# EAGLE design TPDH-Walrus (EAGLE 9.2.2)
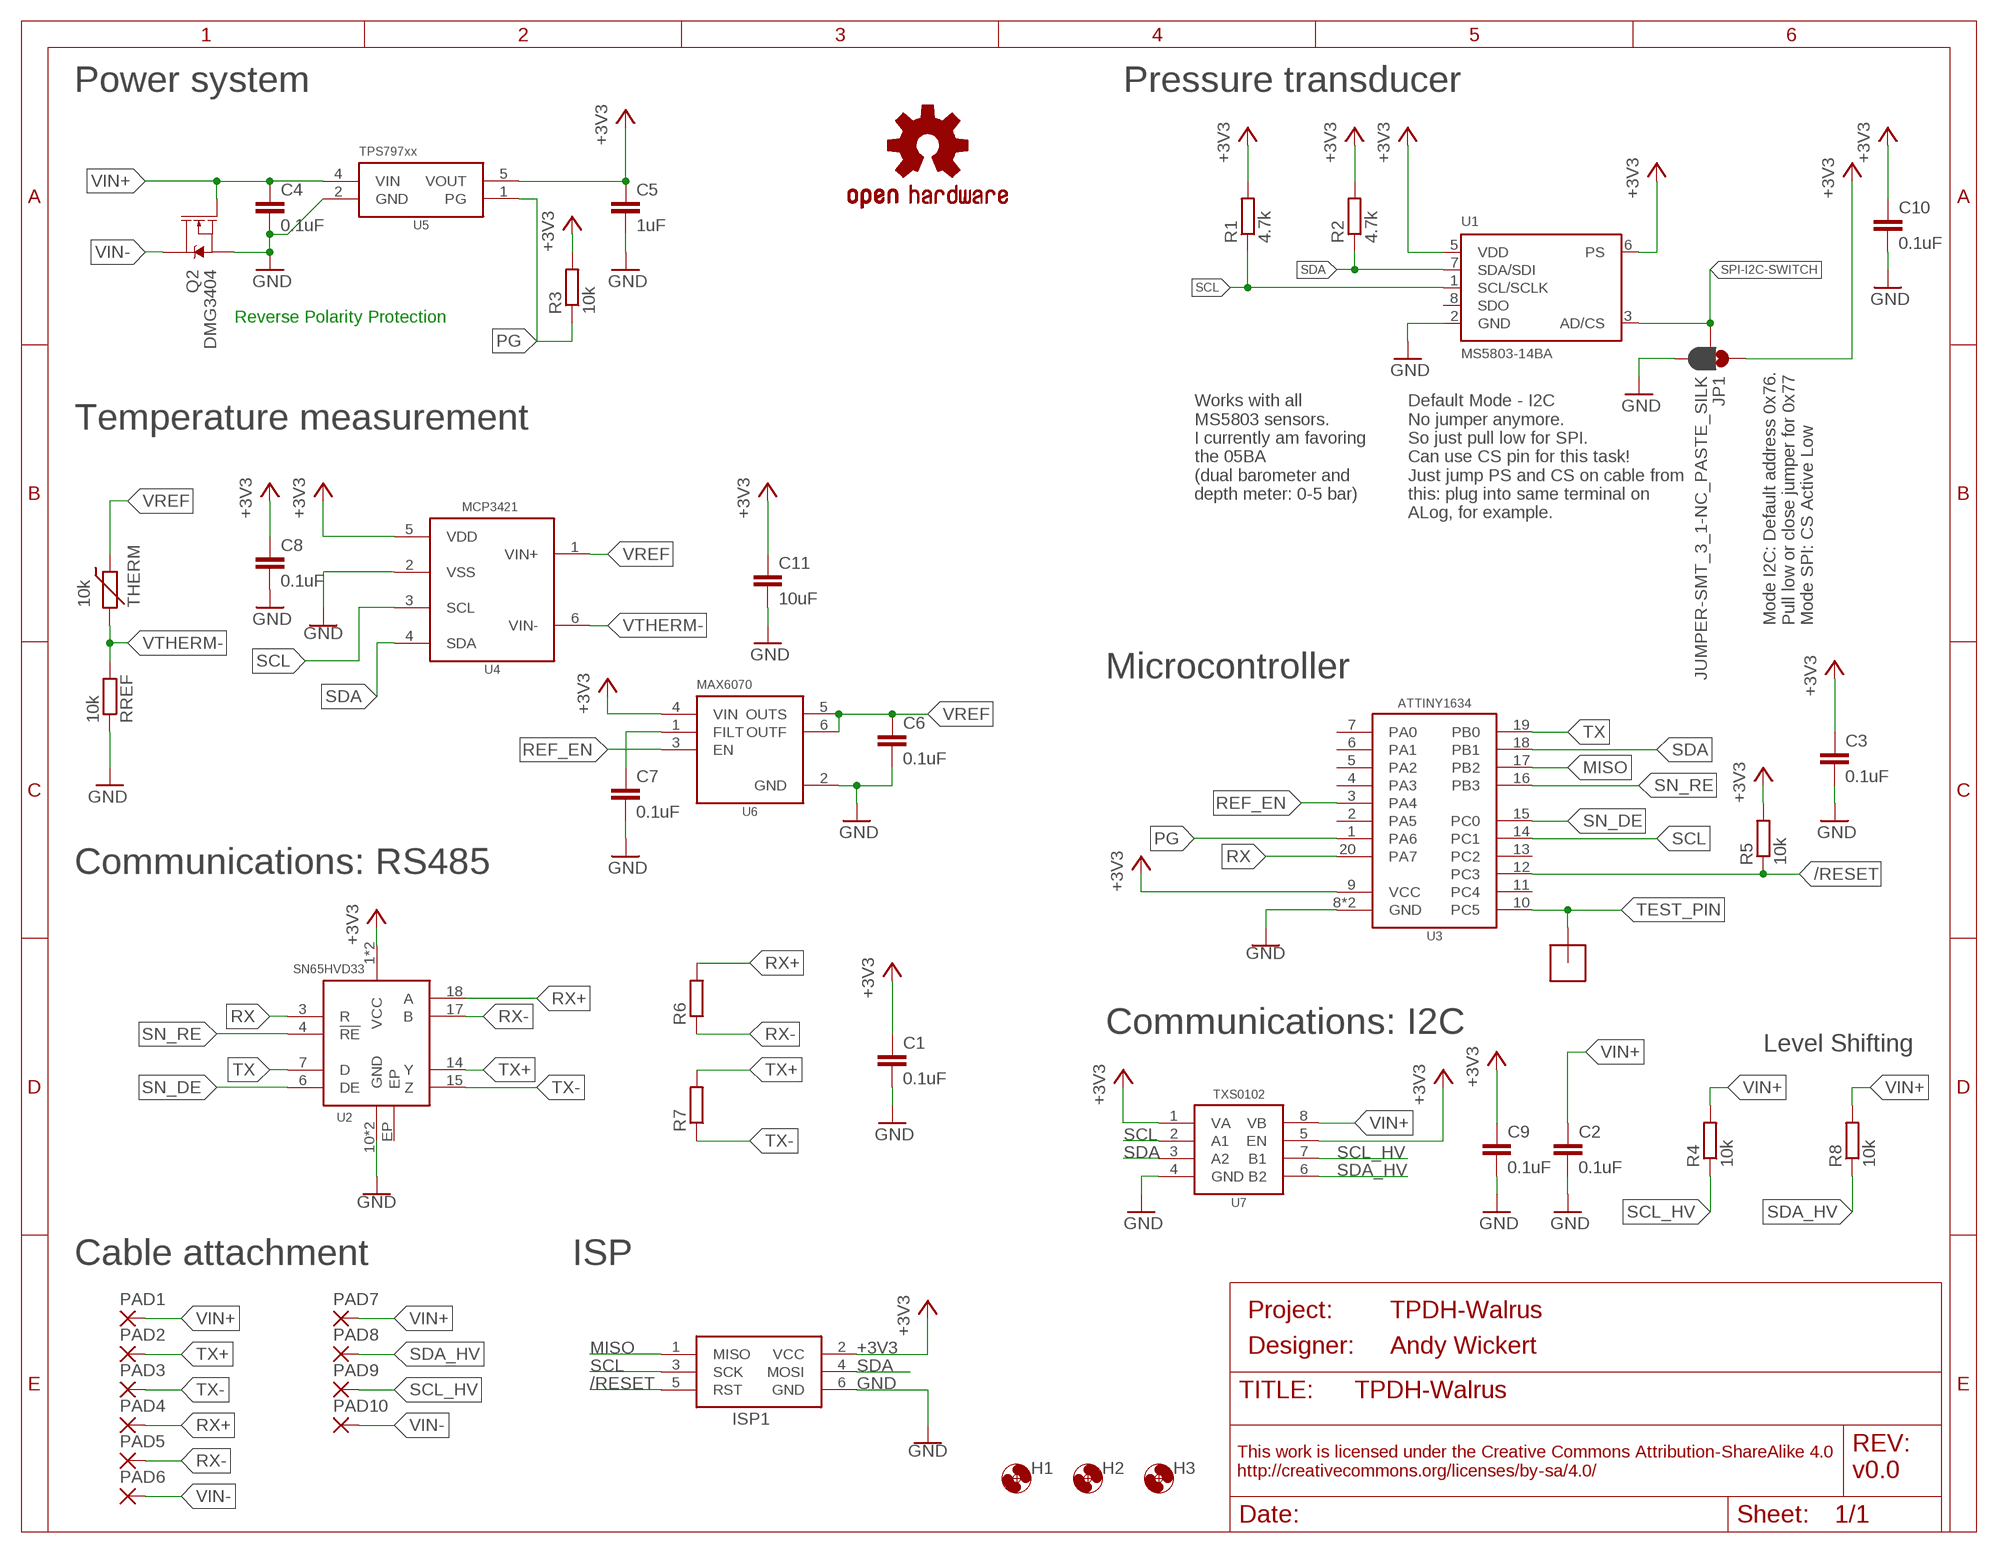
[diagram p0: schematic, sheet 1]
FRAME1 (FRAME_A_L): DESIGNER: Andy Wickert; PROJECT: TPDH-Walrus; REV: v0.0

## Parts
C1  0.1uF  C-EU0.1UFC0402  [C0402]
C2  0.1uF  C-EU0.1UFC0402  [C0402]
C3  0.1uF  C-EU0.1UFC0402  [C0402]
C4  0.1uF  C-EU0.1UFC0402  [C0402]
C5  1uF  C-EU1UFC0603  [C0603]
C6  0.1uF  C-EU0.1UFC0402  [C0402]
C7  0.1uF  C-EU0.1UFC0402  [C0402]
C8  0.1uF  C-EU0.1UFC0402  [C0402]
C9  0.1uF  C-EU0.1UFC0402  [C0402]
C10  0.1uF  C-EU0.1UFC0402  [C0402]
C11  10uF  C-EU10UFC0805  [C0805]
H1  MOUNTING_HOLE2_NP  [2_56]
H2  MOUNTING_HOLE2_NP  [2_56]
H3  MOUNTING_HOLE2_NP  [2_56]
ISP1  AVRISP-6  [AVRISP]
JP1  JUMPER-SMT_3_1-NC_PASTE_SILK  [SMT-JUMPER_3_1-NC_PASTE_SILK]
LOGO1  OSHW-LOGOM  [OSHW-LOGO-M]
PAD1  2,15/1,0  [2,15/1,0]
PAD2  2,15/1,0  [2,15/1,0]
PAD3  2,15/1,0  [2,15/1,0]
PAD4  2,15/1,0  [2,15/1,0]
PAD5  2,15/1,0  [2,15/1,0]
PAD6  2,15/1,0  [2,15/1,0]
PAD7  2,15/1,0  [2,15/1,0]
PAD8  2,15/1,0  [2,15/1,0]
PAD9  2,15/1,0  [2,15/1,0]
PAD10  2,15/1,0  [2,15/1,0]
Q2  DMG3404  MOSFET-NCH-DMG3404L  [SOT23-3]
R1  4.7k  R-EU_4.7KR0402  [R0402]
R2  4.7k  R-EU_4.7KR0402  [R0402]
R3  10k  R-EU_10KR0402  [R0402]
R4  10k  R-EU_10KR0402  [R0402]
R5  10k  R-EU_10KR0402  [R0402]
R6  R-EU_100R0402  [R0402]
R7  R-EU_100R0402  [R0402]
R8  10k  R-EU_10KR0402  [R0402]
RREF  10k  R-EU_P10KR0603  [R0603]
THERM  10k  THERMISTOR10K  [R0603]
U1  MS5803-14BA  [MS5803]
U2  SN65HVD33RHL  [VQFN-20_POWER]
U3  ATTINY1634QFN  [QFN20]
U4  MCP3421A3  [SOT23-6L]
U5  TPS79733  [DCK_R-PDSO-G5]
U6  MAX6070AAUT18  [SOT23-6L]
U7  TXS0102DQM  [DQM_R-PX2SON-N8]
U$12  POGO_PAD  [POGO_PAD]

## Nets
+3V3: C1.1 C3.1 C5.1 C8.1 C9.1 C10.1 C11.1 ISP1.2(VCC) JP1.1 R1.2 R2.2 R3.2 R5.2 U1.5(VDD) U1.6(PS) U2.1(VCC) U2.20(VCC) U3.9(VCC) U4.5(VDD) U5.5(VOUT) U6.4(VIN) U7.1(VA) U7.5(EN)
/RESET: ISP1.5(RST) R5.1 U3.12(PC3)
GND: C1.2 C2.2 C3.2 C4.2 C5.2 C6.2 C7.2 C8.2 C9.2 C10.2 C11.2 ISP1.6(GND) JP1.3 Q2.2(S) RREF.1 U1.2(GND) U2.10(GND) U2.11(GND) U3.8(GND) U3.EP(GND) U4.2(VSS) U5.2(GND) U6.2(GND) U7.4(GND)
MISO: ISP1.1(MISO) U3.17(PB2)
N$11: C7.1 U6.1(FILT)
PG: R3.1 U3.1(PA6) U5.1(PG)
REF_EN: U3.3(PA4) U6.3(EN)
RX: U2.3(R) U3.20(PA7)
RX+: PAD4.1(P) R6.2 U2.18(A)
RX-: PAD5.1(P) R6.1 U2.17(B)
SCL: ISP1.3(SCK) R1.1 U1.1(SCL/SCLK) U3.14(PC1) U4.3(SCL) U7.2(A1)
SCL_HV: PAD9.1(P) R4.1 U7.7(B1)
SDA: ISP1.4(MOSI) R2.1 U1.7(SDA/SDI) U3.18(PB1) U4.4(SDA) U7.3(A2)
SDA_HV: PAD8.1(P) R8.1 U7.6(B2)
SN_DE: U2.6(DE) U3.15(PC0)
SN_RE: U2.4(!RE) U3.16(PB3)
SPI-I2C-SWITCH: JP1.2 U1.3(AD/CS)
TEST_PIN: U3.10(PC5) U$12.P$1
TX: U2.7(D) U3.19(PB0)
TX+: PAD2.1(P) R7.2 U2.14(Y)
TX-: PAD3.1(P) R7.1 U2.15(Z)
VIN+: C2.1 C4.1 PAD1.1(P) PAD7.1(P) Q2.1(G) R4.2 R8.2 U5.4(VIN) U7.8(VB)
VIN-: PAD6.1(P) PAD10.1(P) Q2.3(D)
VREF: C6.1 THERM.1 U4.1(VIN+) U6.5(OUTS) U6.6(OUTF)
VTHERM-: RREF.2 THERM.2 U4.6(VIN-)
Unconnected: U1.8(SDO) U2.EP U3.2(PA5) U3.4(PA3) U3.5(PA2) U3.6(PA1) U3.7(PA0) U3.11(PC4) U3.13(PC2)

## Notes on the sheet
- Power system | Pressure transducer
- Reverse Polarity Protection
- Works with all
  MS5803 sensors.
  I currently am favoring
  the 05BA
  (dual barometer and
  depth meter: 0-5 bar)
- Default Mode - I2C
  No jumper anymore.
  So just pull low for SPI.
  Can use CS pin for this task!
  Just jump PS and CS on cable from
  this: plug into same terminal on
  ALog, for example.
- Temperature measurement
- Mode I2C: Default address 0x76.
  Pull low or close jumper for 0x77
  Mode SPI: CS Active Low
- Microcontroller
- Communications: RS485
- Communications: I2C
- Level Shifting
- Cable attachment | ISP

## Library data of the parts
C1-C4 C6-C10 = bschulz_passives:C-EU: CAPACITOR, European symbol; DIGIKEY: 490-4759-1-ND; MF: Murata; MPN: GCM155R71C104KA55D
C5 = bschulz_passives:C-EU: CAPACITOR, European symbol; DIGIKEY: 490-10479-1-ND; MF: Murata; MPN: GRM188R61C105KA12D
C11 = bschulz:C-EU: CAPACITOR, European symbol; DIGIKEY: 1276-2405-1-ND; MF: Samsung; MPN: CL21A106KQCLRNC
H1-H3 = bschulz:MOUNTING_HOLE: Genaric Mechanical Mounting Hole Hole diameter based on max body diameter + 15% Keepout ring is for diameter of socket cap screw (minimum required clearance) TPlace ring is for diameter of pan head screw (recomended clearance) Specifications: Socket Cap <http://fastener-express.com/fastener-technical/SocketscapSS-Alloy.pdf> Button Head Socket Cap <http://fastener-express.com/fastener-technical/Button-Socket-alloy.pdf> Pan Head <http://fastener-express.com/fastener-technical/pan-machine-Screws.pdf>
ISP1 = bschulz:AVRISP: AVR ISP HEADER Standard 6 pin header for AVR programming
JP1 = SparkFun-Jumpers:JUMPER-SMT_3_1-NC_PASTE: Normally closed solder jumper (1 of 2 connections) This jumper has an aperture in the stencil to allow solder paste to bridge one of the two connections. One connection is normally closed (NC), while the other is normally open (NO). Wick off the solder to open the connection. Reapply solder to reclose the connection. Apply solder to the other side instead to change the current path.
LOGO1 = SparkFun-Aesthetics:OSHW-LOGO: Open-Source Hardware (OSHW) Logo This logo indicates the piece of hardware it is found on incorporates a OSHW license and/or adheres to the definition of open source hardware found here: http://freedomdefined.org/OSHW
PAD1-PAD10 = wirepad:2,15/1,0: THROUGH-HOLE PAD
Q2 = bschulz:MOSFET-NCH: N-channel MOSFETs Voltage controlled devices that allow control of high current outputs. SparkFun Products: SparkFun OpenScale <https://www.sparkfun.com/products/13261> SparkFun Digital Sandbox <https://www.sparkfun.com/products/12651> SparkFun Monster Moto Shield <https://www.sparkfun.com/products/10182> SparkFun MOSFET Power Controller <https://www.sparkfun.com/products/11214>; DIGIKEY: DMG3404L-7DICT-ND; MF: Diodes Incorporated; MPN: DMG3404L-7
R1 R2 = bschulz_passives:R-EU_: RESISTOR, European symbol Digikey Parts: Yageo, 0402 <https://www.digikey.com/products/en/resistors/chip-resistor-surface-mount/52?k=&pkeyword=&sf=0&FV=ffec1104%2Cfffc000d%2C1c0002%2C440067%2C1f140000%2Cffe00034%2C400004&quantity=&ColumnSort=0&page=1&stock=1&pageSize=25> Yageo, 0603 <https://www.digikey.com/products/en/resistors/chip-resistor-surface-mount/52?k=&pkeyword=&s=4356&s=47360&sf=0&FV=fffc000d%2C1c0002%2C142c040c%2C1f140000%2Cffe00034&quantity=10&ColumnSort=1000011&page=1&stock=1&pageSize=25> Panasonic, 0603 <https://www.digikey.com/products/en/resistors/chip-resistor-surface-mount/52?k=&pkeyword=&pv252=68&sf=0&FV=ffec373d%2C1c0002%2C142c040c%2C1f140000%2Cffe00034%2C80002%2Cc0001&quantity=&ColumnSort=0&page=1&stock=1&pageSize=25> Panasonic, precision, 0603 <https://www.digikey.com/products/en/resistors/chip-resistor-surface-mount/52?FV=ffec4907%2Cfffc000a%2Cc0172%2C142c040c%2C1f140000%2Cffe00034%2C1c0002&quantity=100&ColumnSort=2085&page=1&stock=1&pageSize=25> Panasonic, 0805 <https://www.digikey.com/products/en/resistors/chip-resistor-surface-mount/52?k=&pkeyword=&pv3=1&sf=0&FV=ffec373d%2C1c0002%2C1f140000%2Cffe00034%2C142c040d&quantity=&ColumnSort=0&page=1&stock=1&pageSize=25> Rohm, current sense <https://www.digikey.com/products/en/resistors/chip-resistor-surface-mount/52?k=&pkeyword=&pv3=1&sf=0&FV=ffecb688%2C1f140000%2Cffe00034%2C1c0002&quantity=&ColumnSort=0&page=1&stock=1&pageSize=25> Vishay, pulse proof automotive <https://www.digikey.com/products/en/resistors/chip-resistor-surface-mount/52?k=&pkeyword=&pv7=2&sf=0&FV=ffec5d6b%2Cffe00034%2C1f140000&quantity=&ColumnSort=0&page=1&stock=1&pageSize=25>; DIGIKEY: 311-4.7KJRCT-ND; MF: Yageo; MPN: RC0402JR-074K7L; VALUE_PART: 4.7k
R3-R5 R8 = bschulz_passives:R-EU_: RESISTOR, European symbol Digikey Parts: Yageo, 0402 <https://www.digikey.com/products/en/resistors/chip-resistor-surface-mount/52?k=&pkeyword=&sf=0&FV=ffec1104%2Cfffc000d%2C1c0002%2C440067%2C1f140000%2Cffe00034%2C400004&quantity=&ColumnSort=0&page=1&stock=1&pageSize=25> Yageo, 0603 <https://www.digikey.com/products/en/resistors/chip-resistor-surface-mount/52?k=&pkeyword=&s=4356&s=47360&sf=0&FV=fffc000d%2C1c0002%2C142c040c%2C1f140000%2Cffe00034&quantity=10&ColumnSort=1000011&page=1&stock=1&pageSize=25> Panasonic, 0603 <https://www.digikey.com/products/en/resistors/chip-resistor-surface-mount/52?k=&pkeyword=&pv252=68&sf=0&FV=ffec373d%2C1c0002%2C142c040c%2C1f140000%2Cffe00034%2C80002%2Cc0001&quantity=&ColumnSort=0&page=1&stock=1&pageSize=25> Panasonic, precision, 0603 <https://www.digikey.com/products/en/resistors/chip-resistor-surface-mount/52?FV=ffec4907%2Cfffc000a%2Cc0172%2C142c040c%2C1f140000%2Cffe00034%2C1c0002&quantity=100&ColumnSort=2085&page=1&stock=1&pageSize=25> Panasonic, 0805 <https://www.digikey.com/products/en/resistors/chip-resistor-surface-mount/52?k=&pkeyword=&pv3=1&sf=0&FV=ffec373d%2C1c0002%2C1f140000%2Cffe00034%2C142c040d&quantity=&ColumnSort=0&page=1&stock=1&pageSize=25> Rohm, current sense <https://www.digikey.com/products/en/resistors/chip-resistor-surface-mount/52?k=&pkeyword=&pv3=1&sf=0&FV=ffecb688%2C1f140000%2Cffe00034%2C1c0002&quantity=&ColumnSort=0&page=1&stock=1&pageSize=25> Vishay, pulse proof automotive <https://www.digikey.com/products/en/resistors/chip-resistor-surface-mount/52?k=&pkeyword=&pv7=2&sf=0&FV=ffec5d6b%2Cffe00034%2C1f140000&quantity=&ColumnSort=0&page=1&stock=1&pageSize=25>; DIGIKEY: 311-10KJRCT-ND; MF: Yageo; MPN: RC0402JR-0710KL; VALUE_PART: 10k
R6 R7 = bschulz_passives:R-EU_: RESISTOR, European symbol Digikey Parts: Yageo, 0402 <https://www.digikey.com/products/en/resistors/chip-resistor-surface-mount/52?k=&pkeyword=&sf=0&FV=ffec1104%2Cfffc000d%2C1c0002%2C440067%2C1f140000%2Cffe00034%2C400004&quantity=&ColumnSort=0&page=1&stock=1&pageSize=25> Yageo, 0603 <https://www.digikey.com/products/en/resistors/chip-resistor-surface-mount/52?k=&pkeyword=&s=4356&s=47360&sf=0&FV=fffc000d%2C1c0002%2C142c040c%2C1f140000%2Cffe00034&quantity=10&ColumnSort=1000011&page=1&stock=1&pageSize=25> Panasonic, 0603 <https://www.digikey.com/products/en/resistors/chip-resistor-surface-mount/52?k=&pkeyword=&pv252=68&sf=0&FV=ffec373d%2C1c0002%2C142c040c%2C1f140000%2Cffe00034%2C80002%2Cc0001&quantity=&ColumnSort=0&page=1&stock=1&pageSize=25> Panasonic, precision, 0603 <https://www.digikey.com/products/en/resistors/chip-resistor-surface-mount/52?FV=ffec4907%2Cfffc000a%2Cc0172%2C142c040c%2C1f140000%2Cffe00034%2C1c0002&quantity=100&ColumnSort=2085&page=1&stock=1&pageSize=25> Panasonic, 0805 <https://www.digikey.com/products/en/resistors/chip-resistor-surface-mount/52?k=&pkeyword=&pv3=1&sf=0&FV=ffec373d%2C1c0002%2C1f140000%2Cffe00034%2C142c040d&quantity=&ColumnSort=0&page=1&stock=1&pageSize=25> Rohm, current sense <https://www.digikey.com/products/en/resistors/chip-resistor-surface-mount/52?k=&pkeyword=&pv3=1&sf=0&FV=ffecb688%2C1f140000%2Cffe00034%2C1c0002&quantity=&ColumnSort=0&page=1&stock=1&pageSize=25> Vishay, pulse proof automotive <https://www.digikey.com/products/en/resistors/chip-resistor-surface-mount/52?k=&pkeyword=&pv7=2&sf=0&FV=ffec5d6b%2Cffe00034%2C1f140000&quantity=&ColumnSort=0&page=1&stock=1&pageSize=25>; DIGIKEY: 311-100LRCT-ND; MF: Yageo; MPN: RC0402FR-07100RL; VALUE_PART: 100
RREF = bschulz_passives:R-EU_: RESISTOR, European symbol Digikey Parts: Yageo, 0402 <https://www.digikey.com/products/en/resistors/chip-resistor-surface-mount/52?k=&pkeyword=&sf=0&FV=ffec1104%2Cfffc000d%2C1c0002%2C440067%2C1f140000%2Cffe00034%2C400004&quantity=&ColumnSort=0&page=1&stock=1&pageSize=25> Yageo, 0603 <https://www.digikey.com/products/en/resistors/chip-resistor-surface-mount/52?k=&pkeyword=&s=4356&s=47360&sf=0&FV=fffc000d%2C1c0002%2C142c040c%2C1f140000%2Cffe00034&quantity=10&ColumnSort=1000011&page=1&stock=1&pageSize=25> Panasonic, 0603 <https://www.digikey.com/products/en/resistors/chip-resistor-surface-mount/52?k=&pkeyword=&pv252=68&sf=0&FV=ffec373d%2C1c0002%2C142c040c%2C1f140000%2Cffe00034%2C80002%2Cc0001&quantity=&ColumnSort=0&page=1&stock=1&pageSize=25> Panasonic, precision, 0603 <https://www.digikey.com/products/en/resistors/chip-resistor-surface-mount/52?FV=ffec4907%2Cfffc000a%2Cc0172%2C142c040c%2C1f140000%2Cffe00034%2C1c0002&quantity=100&ColumnSort=2085&page=1&stock=1&pageSize=25> Panasonic, 0805 <https://www.digikey.com/products/en/resistors/chip-resistor-surface-mount/52?k=&pkeyword=&pv3=1&sf=0&FV=ffec373d%2C1c0002%2C1f140000%2Cffe00034%2C142c040d&quantity=&ColumnSort=0&page=1&stock=1&pageSize=25> Rohm, current sense <https://www.digikey.com/products/en/resistors/chip-resistor-surface-mount/52?k=&pkeyword=&pv3=1&sf=0&FV=ffecb688%2C1f140000%2Cffe00034%2C1c0002&quantity=&ColumnSort=0&page=1&stock=1&pageSize=25> Vishay, pulse proof automotive <https://www.digikey.com/products/en/resistors/chip-resistor-surface-mount/52?k=&pkeyword=&pv7=2&sf=0&FV=ffec5d6b%2Cffe00034%2C1f140000&quantity=&ColumnSort=0&page=1&stock=1&pageSize=25>; DIGIKEY: P10KDBCT-ND; MF: Panasonic; MPN: ERA-3AEB103V; VALUE_PART: 10k
THERM = bschulz:THERMISTOR: Thermistor NTC Thermistors: Digikey = 490-12101-1-ND, R25 = 47K, Package = 0603 Digikey = 490-16279-1-ND, R25 = 10K, Package = 0603; DIGIKEY: 490-16279-1-ND; MF: Murata; MPN: NCU18XH103F60RB
U1 = MS5803:MS5803-14BA; DIGIKEY: 223-1625-5-ND; MF: TE; MPN: MS580305BA01-00; PROD_ID: IC-12111
U2 = bschulz:SN65HVD33: SN65HVD33 - Full Duplex RS-485 Tranciver, with output enable Characteristics: VCC: 3~3.6V Operating Temperature: -40°C to 85°C Signaling Rate: 1, 5, 26 Mbps (depending on model) Digikey: 296-24087-1-ND (RHL) <https://www.digikey.com/product-detail/en/texas-instruments/SN65HVD33RHLR/296-24087-1-ND/1991606> 296-18704-1-ND (D) <https://www.digikey.com/product-detail/en/texas-instruments/SN65HVD33DR/296-18704-1-ND/863533>; DIGIKEY: 296-24087-1-ND; MF: TI; MPN: SN65HVD33RHLR
U3 = bschulz:ATTINY1634: ATtiny1634 8 bit AVR Microcontroller Features: Vcc: 1.8 ~ 5.5V Clock: Up to 16MHz, Internal 8MHz FRC, 32kHz RC Flash Memory: 16K SRAM: 1K EEPROM: 256B ADC: 10b, 12 port USART: Yes, x2 SPI: Yes I2C: Yes, slave only Notes: 2 analog comp. Digikey: ATTINY1634R-MURCT-ND (QFN) <https://www.digikey.com/product-detail/en/microchip-technology/ATTINY1634R-MUR/ATTINY1634R-MURCT-ND/3440781> ATTINY1634R-SU-ND (SOIC) <https://www.digikey.com/product-detail/en/ATTINY1634R-SU/ATTINY1634R-SU-ND/3128699/?itemSeq=272981030>; DIGIKEY: ATTINY1634-MURCT-ND; MF: Atmel; MPN: ATTINY1634-MUR
U4 = bschulz:MCP342*: MCP342* - Sigma Delta ADC Characteristics: VCC: 2.7~5.5V Operating Temperature: -40°C to 125°C Number of Inputs: 1 (Differenital) Sample Rate: 15 Samples Per Second Number of Bits: 16 (MCP3425), 18 (MCP3421) Digikey: MCP3421 MCP3425A0T-E/CHCT-ND <https://www.digikey.com/product-detail/en/microchip-technology/MCP3425A0T-E-CH/MCP3425A0T-E-CHCT-ND/1979810> MCP3425 MCP3421A0T-E/CHCT-ND <https://www.digikey.com/product-detail/en/microchip-technology/MCP3421A0T-E-CH/MCP3421A0T-E-CHCT-ND/2183406> MCP3421A1T-E/CHCT-ND <https://www.digikey.com/product-detail/en/microchip-technology/MCP3421A1T-E-CH/MCP3421A1T-E-CHCT-ND/2183407> MCP3421A3T-E/CHCT-ND <https://www.digikey.com/product-detail/en/microchip-technology/MCP3421A3T-E-CH/MCP3421A3T-E-CHCT-ND/2183409>; DIGIKEY: MCP3421A3T-E/CHCT-ND; DISP: MCP3421; MF: Microchip; MPN: MCP3421A3T-E/CH
U5 = bschulz:TPS797*: TPS797* - Ultra Low Power Low Dropout Linear Regulator Characteristics: Vin: 1.4V ~ 5.5V Vout: 1.8, 2.85, 3.0, 3.3V fixed IQ: 1.2μA typ, 2μA max Voltage Accuracy: 4% max Dropout Voltage: 105mV @ 10mA Output Current: 50 mA Operating Temperature: -40°C to 85°C Digikey: TPS79733 (3.3V Fixed) <https://www.digikey.com/product-detail/en/texas-instruments/TPS79733DCKR/296-11990-1-ND/390520> TPS79730 (3.0V Fixed) <https://www.digikey.com/product-detail/en/texas-instruments/TPS79730DCKR/296-11989-1-ND/390518> TPS797285 (2.85V Fixed) <https://www.digikey.com/product-detail/en/texas-instruments/TPS797285DCKR/296-25465-1-ND/2187585> TPS79718 (1.8V Fixed) <https://www.digikey.com/product-detail/en/texas-instruments/TPS79718DCKR/296-11988-1-ND/390516>; DIGIKEY: 296-11990-1-ND; MF: TI; MPN: TPS79733DCKR
U6 = bschulz:MAX6070AAUT*: MAX6070 Low Noise high precision voltage referance; DIGIKEY: MAX6070BAUT18+TCT-ND; MF: Maxim; MPN: MAX6070BAUT18+T
U7 = bschulz:TXS0102: TXS0102 - 2 Channel Bidirectional Voltage Level Translator Characteristics: Vcc: 1.65 ~ 3.6V (Port A), 2.3 ~ 5.5V (Port B) IQ: 14.4μA Output Current: 50mA Output Type: Open Drain/Push-Pull Operating Temperature: -40°C to 85°C Digikey: 296-28368-1-ND (DQE) <https://www.digikey.com/product-detail/en/texas-instruments/TXS0102DQER/296-28368-1-ND/2625893> 296-28435-1-ND (DQM) <https://www.digikey.com/product-detail/en/texas-instruments/TXS0102DQMR/296-28435-1-ND/2638910> 296-21931-1-ND (DCU) <https://www.digikey.com/product-detail/en/texas-instruments/TXS0102DCUR/296-21931-1-ND/1629284>; DIGIKEY: 296-28435-1-ND; MF: TI; MPN: TXS0102DQMR
U$12 = bschulz:POGO_PAD: POGO Pad SMD pad for interfacing with POGO Pins

## Board
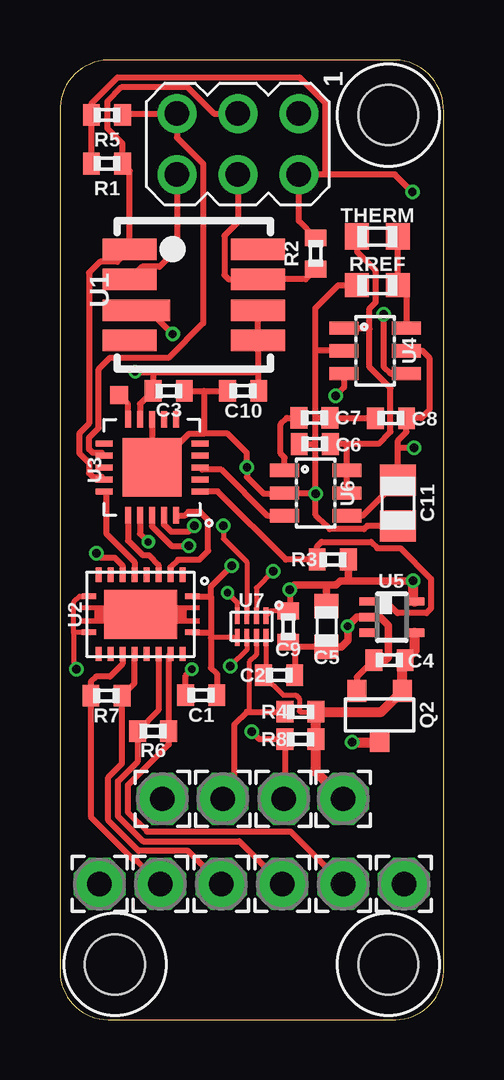
[diagram p1: board, top side]
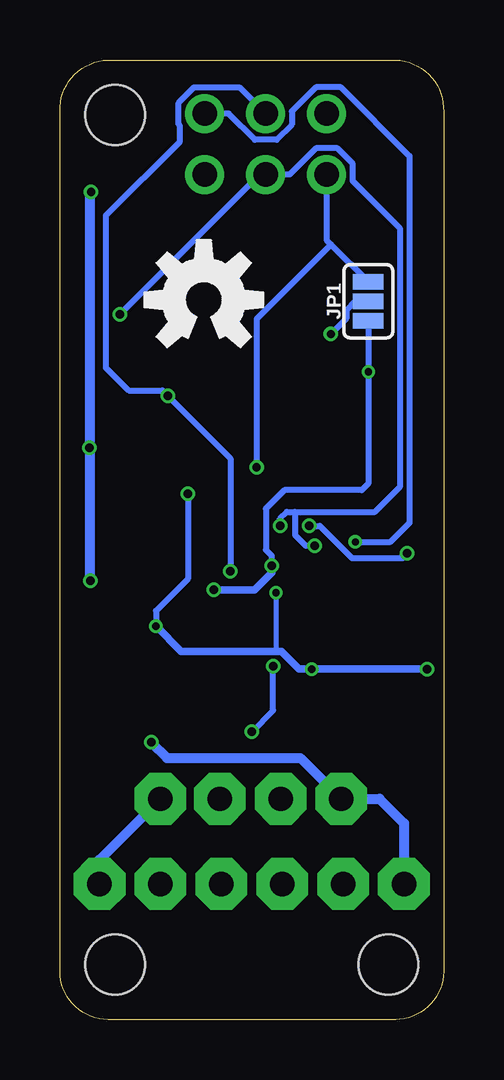
[diagram p2: board, bottom side, seen from below]

Size 16 x 40 mm. Coordinates in mm from the lower left corner, seen from the top.
Outline: 2,0 14,0 arc90 16,2 16,37.85 arc90 14,40 2,40 arc90 0,37.84 0,2 arc90 2,0
Copper layers (1*16): Top 0.035559375mm / dielectric 1.6mm / Bottom 0.035559375mm
Design rules "oshpark-2layer": minimum track width 6mil, minimum drill 10mil, track to track 6mil, track to pad 6mil, pad to pad 6mil, via to via 6mil, smd to smd 6mil, copper to edge 15mil, drill to drill 6mil, minimum pad ring 5mil, minimum via ring 5mil, stop-mask expansion 2.5mil, vias tented up to drill 0mil, thermal gap 10mil

### Footprints (pad centres in the part's own frame; a part is rotated, then mirrored left to right if it is on the bottom)
C0402 = smd 0.7 x 0.9: 1 -0.65,0; 2 0.65,0
C0603 = smd 1 x 1: 1 -0.85,0; 2 0.85,0
C0805 = smd 1.3 x 1.5: 1 -0.95,0; 2 0.95,0
2_56 = hole 2.5: 0,0
AVRISP = drill 1.02 pad 1.626: 1 -1.27,2.54; 2 1.27,2.54; 3 -1.27,0; 4 1.27,0; 5 -1.27,-2.54; 6 1.27,-2.54
SMT-JUMPER_3_1-NC_PASTE_SILK = smd 0.635 x 1.27: 1 -0.813,0; 2 0,0; 3 0.813,0
2,15/1,0 = drill 1.016 pad 2.159 octagon: 1 0,0
SOT23-3 = smd 0.8 x 0.9: 1 -0.95,-1; 2 0.95,-1; 3 0,1.1
R0402 = smd 0.7 x 0.9: 1 -0.65,0; 2 0.65,0
R0603 = smd 1 x 1: 1 -0.85,0; 2 0.85,0
R0603' = smd 1 x 1.1: 1 -0.85,0; 2 0.85,0
MS5803 = smd 2.25 x 0.9: 1 -2.675,1.9; 2 -2.675,0.65; 4 -2.675,-1.9; 5 2.675,-1.9; 6 2.675,-0.65; 7 2.675,0.65; 8 2.675,1.9 | smd 2.8 x 0.9: 3 -2.4,-0.65
VQFN-20_POWER = smd 0.24 x 0.6: 1 -0.75,2.15; 10 -0.75,-2.15; 11 0.75,-2.15; 20 0.75,2.15 | smd 0.6 x 0.24: 2 -1.65,1.75; 3 -1.65,1.25; 4 -1.65,0.75; 5 -1.65,0.25; 6 -1.65,-0.25; 7 -1.65,-0.75; 8 -1.65,-1.25; 9 -1.65,-1.75; 12 1.65,-1.75; 13 1.65,-1.25; 14 1.65,-0.75; 15 1.65,-0.25; 16 1.65,0.25; 17 1.65,0.75; 18 1.65,1.25; 19 1.65,1.75 | smd 2.05 x 3.05: EP 0,0
QFN20 = smd 0.7 x 0.25: 1 -2.032,0.968; 2 -2.032,0.468; 3 -2.032,-0.032; 4 -2.032,-0.532; 5 -2.032,-1.032; 11 1.968,-1.032; 12 1.968,-0.532; 13 1.968,-0.032; 14 1.968,0.468; 15 1.968,0.968 | smd 0.25 x 0.7: 6 -1.032,-2.032; 7 -0.532,-2.032; 8 -0.032,-2.032; 9 0.468,-2.032; 10 0.968,-2.032; 16 0.968,1.968; 17 0.468,1.968; 18 -0.032,1.968; 19 -0.532,1.968; 20 -1.032,1.968 | smd 2.45 x 2.45: EP -0.032,-0.032
SOT23-6L = smd 0.55 x 1.2: 1 -0.95,-1.3; 2 0,-1.3; 3 0.95,-1.3; 4 0.95,1.3; 5 0,1.3; 6 -0.95,1.3
DCK_R-PDSO-G5 = smd 0.35 x 0.8: 1 -0.65,-0.95; 2 0,-0.95; 3 0.65,-0.95; 4 0.65,0.95; 5 -0.65,0.95
DQM_R-PX2SON-N8 = smd 0.2 x 0.7: 1 -0.6,-0.45; 2 -0.2,-0.45; 3 0.2,-0.45; 4 0.6,-0.45; 5 0.6,0.45; 6 0.2,0.45; 7 -0.2,0.45; 8 -0.6,0.45
POGO_PAD = smd 0.75 x 0.75: P$1 0,0

### Placement (x,y rotation side)
C1  5.89,13.52 180 top
C2  9.14,14.35 0 top
C3  4.54,26.2 0 top
C4  13.75,14.98 180 top
C5  11.11,16.38 270 top
C6  10.63,23.99 180 top
C7  10.61,25.08 0 top
C8  13.81,25.07 180 top
C9  9.53,16.38 270 top
C10  7.64,26.2 180 top
C11  14.1,21.53 270 top
H1  13.7,37.7 0 top
H2  13.7,2.3 0 top
H3  2.3,2.3 0 top
ISP1  7.42,36.49 270 top
JP1  3.14,29.94 90 bottom
LOGO1  10,30 0 bottom
PAD1  14.35,5.65 0 top
PAD2  4.19,5.65 0 top
PAD3  6.73,5.65 0 top
PAD4  11.81,5.65 0 top
PAD5  9.27,5.65 0 top
PAD6  1.65,5.65 0 top
PAD7  11.81,9.2 0 top
PAD8  9.33,9.2 0 top
PAD9  6.79,9.2 0 top
PAD10  4.27,9.2 0 top
Q2  13.34,12.7 180 top
R1  1.96,35.68 180 top
R2  10.66,31.93 90 top
R3  11.38,19.18 0 top
R4  10.03,12.83 0 top
R5  1.96,37.71 180 top
R6  3.89,12.02 0 top
R7  1.94,13.5 180 top
R8  10.03,11.68 0 top
RREF  13.24,30.61 0 top
THERM  10k  [R0603']  13.24,32.64 0 top
U1  5.59,30.21 0 top
U2  3.36,16.89 270 top
U3  3.81,22.99 180 top
U4  13.15,27.88 270 top
U5  13.85,16.78 270 top
U6  10.67,21.95 270 top
U7  7.99,16.38 180 top
U$12  2.48,26.04 0 top

### Tracks (layer width: path | path; a pad name or v marks a point on that pad's centre or on a via)
+3V3  (via drill 0.3, 0.35)
  Top 0.2: C9.1 8.79,17.03 U7.1 | U7.5 6.33,15.93 6.3,15.9
  Top 0.254: U1.6 U1.5 8.26,27 | v9.59,17.92 9.59,17.1 C9.1 | U6.4 12.61,21 C11.1 14.1,23.83 | R1.2 R5.2 1.31,38.18 2.39,39.26 10.01,39.26 11.05,38.21 11.05,35.27 11,35.22 | v3.14,27 3.9,27 | 3.9,27 3.9,26.22 C3.1 3.34,25.66 U3.9 | v14.77,23.83 14.1,23.83 | 14.1,23.83 14.1,24.14 14.46,24.5 C8.1 15.07,25.07 15.4,25.4 15.4,27.6 15.12,27.88 U4.5 | 8.26,27 8.26,26.23 C10.1 | 3.9,27 8.26,27 | R2.2 9.96,33.28 ISP1.2 11,35.22 | v14.7,34.5 13.98,35.22 11,35.22 | v7.17,18.91 6.3,18.05 6.3,17.64 | U2.1 6.3,17.64 | C1.1 6.54,14.42 6.3,14.66 6.3,15.9 6.3,16.2 | 6.3,17.64 6.3,16.2 | U2.20 6.24,16.14 6.3,16.2
  Top 0.305: v14.73,18.29 12.03,18.29 | 12.03,18.29 11.69,18.29 11.52,18.12 11.1,18.12 | v9.59,17.92 9.79,18.12 11.1,18.12 | C5.1 11.11,18.1 11.1,18.12 | R3.2 12.03,18.29
  Top 0.406: U5.5 14.73,17.49 v14.73,18.29
  Bottom 0.254: v14.77,23.83 14.73,23.83 | JP1.1 v3.14,27 3.14,22.34 3.42,22.06 6.64,22.06 7.41,21.29 7.41,19.57 7.17,19.33 v7.17,18.91
  Bottom 0.305: v9.59,17.92 7.88,17.92 7.17,18.63 v7.17,18.91
  Bottom 0.406: v14.73,18.29 14.73,23.83 14.73,34.47 v14.7,34.5
/RESET
  Top 0.254: U3.12 1.75,23.61 1.38,23.61 1.21,23.78 1.21,24.26 1.62,24.67 1.62,27.12 2.08,27.58 4.53,27.58 5.97,29.02 5.97,35.67 4.88,36.77 ISP1.5 2.67,37.76 R5.1
GND  (via drill 0.3, 0.35)
  Top 0.2: 0.58,16.1 0.58,14.71 v0.68,14.61 | 0.58,16.1 0.58,17.41 0.81,17.64 U2.10 | U2.11 0.62,16.14 0.58,16.1 | v6.99,17.79 7.39,17.38 U7.4
  Top 0.254: C9.2 9.79,15.46 | 9.79,15.46 C2.2 | C4.2 12.38,14.27 Q2.2 | C5.2 9.86,15.53 9.79,15.46 | C8.2 13.14,25.08 C7.2 10.74,25.08 10.65,25 | U3.8 U3.EP 3.97,23.02 5.38,24.42 6,24.42 | v10.66,21.92 9.39,21.92 | 9.39,21.92 U6.2 | 9.39,21.92 8.5,21.92 7.8,22.62 v7.8,23.02 7.8,23.62 7,24.42 6,24.42 | C11.2 12.82,20.58 12.68,20.44 11.25,20.44 11.09,20.61 10.66,21.04 v10.66,21.92 | v10.66,21.92 10.66,23.41 10.65,23.42 10.65,24 | C6.2 9.99,24 10.65,24 | 10.65,24 10.65,25 | C3.2 6,26.2 | 6,26.2 C10.2 | 6,26.2 6,24.42 | RREF.1 11.61,30.61 10.65,29.65 10.65,27.9 | 10.65,25 10.65,27.9 | U4.2 10.67,27.88 10.65,27.9 | C1.2 5.24,14.34 v5.5,14.61 | U1.2 3.43,31.38 4.15,31.38 4.88,32.1 ISP1.6
  Top 0.305: C4.2 13.58,14.98 13.7,15.1 13.7,16.43 13.35,16.78 U5.2 12.38,16.78 v12,16.4 12,15.8 11.73,15.53 C5.2
  Bottom 0.2: v6.99,17.79 6.99,15.34 | v5.5,14.61 6.03,14.61
  Bottom 0.254: v10.66,21.92 10.66,18.37 12,17.03 v12,16.4 | ISP1.6 4.88,32.49 4.69,32.31 | 4.69,32.31 JP1.3 | 4.69,32.31 7.8,29.2 v7.8,23.02
  Bottom 0.305: v12,16.4 10.94,15.34 6.99,15.34 6.76,15.34 6.03,14.61 v0.68,14.61
MISO  (via drill 0.3)
  Top 0.254: U3.17 3.34,20.25 v3.68,19.91
  Bottom 0.254: ISP1.1 8.96,37.76 7.87,36.67 6.97,36.67 6.33,37.31 6.33,37.86 5.33,38.85 4.28,38.85 1.43,36 1.43,20.7 2.21,19.91 v3.68,19.91
N$11
  Top 0.254: C7.1 9.46,25.08 9.2,24.82 9.2,23.6 9.35,23.45 9.35,23.42 9.37,23.41 U6.1
PG
  Top 0.254: U5.1 13.59,17.43 14.07,16.94 15.28,16.94 15.47,17.14 15.47,18.37 14.19,19.65 13.23,19.65 12.97,19.91 10.91,19.91 10.73,19.73 R3.1 9.42,19.18 6.58,22.02 U3.1
REF_EN
  Top 0.254: U6.3 8.66,21 6.73,22.92 5.94,22.92 U3.3
RX
  Top 0.254: U3.20 5.22,21.02 5.36,21.16 5.84,21.16 6.18,20.82 6.18,19.54 5.81,19.17 4.92,19.17 4.61,18.86 U2.3
RX+
  Top 0.254: PAD4.1 9.62,7.84 3.63,7.84 2.83,8.64 2.83,9.76 4.54,11.47 R6.2 4.54,15.16 U2.18
RX-
  Top 0.254: PAD5.1 7.49,7.43 3.46,7.43 2.42,8.47 2.42,9.93 3.24,10.74 R6.1 4.11,12.9 U2.17
SCL  (via drill 0.35)
  Top 0.2: v8.89,18.69 8.19,17.99 U7.2
  Top 0.254: U3.14 1.75,22.61 1.38,22.61 1.21,22.78 1.21,23.2 0.81,23.61 0.81,24.43 1.21,24.83 1.21,31.13 1.67,31.59 2.39,31.59 U1.1 2.91,35.38 R1.1 2.61,36.51 1.98,37.14 1.98,38.27 2.56,38.85 5.33,38.85 6.42,37.76 ISP1.3 | U4.3 11.85,26.35 v11.5,26
  Bottom 0.254: v8.89,18.69 8.89,23.39 v11.5,26 11.72,26.22 13.13,26.22 14.07,27.16 14.07,33.53 11,36.6 11,37.26 11.05,37.31 11.05,38.21 10.41,38.85 8.51,38.85 ISP1.3
SCL_HV
  Top 0.2: U7.7 8.19,15.21 7.89,14.91 7.89,12.92 7.8,12.83
  Top 0.254: R4.1 7.8,12.83 7.26,12.29 7.26,9.68 PAD9.1
SDA  (via drill 0.35)
  Top 0.2: v6.82,20.58 6.82,20.04 7.79,19.07 U7.3
  Top 0.254: ISP1.4 7.42,33.24 6.86,32.67 6.86,31.04 7.04,30.86 U1.7 10.24,30.86 R2.1 | U3.18 3.84,20.56 4.65,19.75 v5.37,19.75 | v13.49,29.4 13.49,27.21 13.77,26.93 U4.4
  Bottom 0.254: v13.49,29.4 7.67,35.22 ISP1.4 6.42,35.22 5.33,36.31 4.43,36.31 3.79,35.67 3.79,34.95 1.83,33 1.83,22.19 2.86,21.16 6.2,21.16 | v6.82,20.58 6.82,20.88 6.54,21.16 6.2,21.16 | v5.37,19.75 5.75,19.75 6.18,20.18 6.18,21.15 6.2,21.16
SDA_HV  (via drill 0.35)
  Top 0.2: U7.6 7.79,15.41 v7.11,14.73
  Top 0.254: PAD8.1 9.38,9.25 R8.1 8.32,11.68 v8,12
  Bottom 0.254: v8,12 7.11,12.89 v7.11,14.73
SN_DE
  Top 0.254: U2.6 3.11,19.08 1.94,20.26 1.94,21.93 U3.15
SN_RE
  Top 0.254: U2.4 4.11,18.95 3.71,19.36 3.45,19.36 2.84,19.96 U3.16
SPI-I2C-SWITCH  (via drill 0.35)
  Top 0.254: U1.3 3.71,29.56 v4.7,28.57
  Bottom 0.254: v4.7,28.57 4.05,29.22 4.05,29.56 3.67,29.94 JP1.2
TEST_PIN
  Top 0.254: U3.10 2.84,25.67 U$12.P$1
TX  (via drill 0.35)
  Top 0.254: U3.19 4.34,20.63 4.64,20.34 5.36,20.34 v5.6,20.58 | U2.7 2.61,18.93 2.3,19.24 1.7,19.24 v1.51,19.43
  Bottom 0.254: v5.6,20.58 5.16,20.58 3.81,19.23 1.71,19.23 v1.51,19.43
TX+
  Top 0.254: PAD2.1 3.22,6.62 3.12,6.62 1.29,8.45 R7.2 1.29,14.09 1.5,14.3 2.09,14.3 2.61,14.82 U2.14
TX-
  Top 0.254: U2.15 3.11,14.02 R7.1 2.59,10.67 2.02,10.1 2.02,8.3 3.29,7.03 5.35,7.03 PAD3.1
VIN+
  Top 0.2: U7.8 8.59,14.45 C2.1 9.32,13.53 9.84,13.53 9.98,13.38 9.98,12.86 10.02,12.83 R4.2
  Top 0.406: U5.4 14.8,15.38 C4.1 14.29,14.87 Q2.1 13.41,12.83 R4.2 R8.2 10.68,10.33 PAD7.1
  Bottom 0.406: PAD7.1 14.35,6.66 PAD1.1
VIN-  (via drill 0.35)
  Top 0.406: v12.19,11.56 13.29,11.56 Q2.3
  Bottom 0.406: PAD6.1 1.65,8.18 2.67,9.2 PAD10.1 5.97,10.9 11.54,10.9 v12.19,11.56
VREF
  Top 0.254: U6.5 U6.6 11.97,23.96 12,23.99 | THERM.1 12.39,32 13.17,31.22 13.17,29.9 12.91,29.64 12.91,28.8 | 12,23.99 13.27,23.99 13.79,24.5 13.79,26.32 12.91,27.19 12.91,28.8 | 12,23.99 C6.1 | U4.1 12.88,28.83 12.91,28.8
VTHERM-
  Top 0.254: U4.6 14.45,30.25 RREF.2 THERM.2

### Text on the board
Reference: Andrew D. Wickert
tDocu: V- | SCL | SDA | V+ | I2C / <3 m | V- | Tx+ | Tx- | Rx- | Rx+ | V+ | RS485: <1000 m
bDocu: 0x77 | DEFAULT | ALT | 0x76 | Project-TPDH-Walrus / v0.0.0 / 02-26-2018 / / Based on TP-Downhole by / Schulz, Sandell, Wickert / / A. Wickert / / Northern Widget LLC / and University of Minnesota | V- | SCL | SDA | V+ | I2C / <3 m | V- | Tx+ | Tx- | Rx- | Rx+ | V+ | RS485: <1000 m